# Altium project Group8_EnvironmentStation.PrjPcb
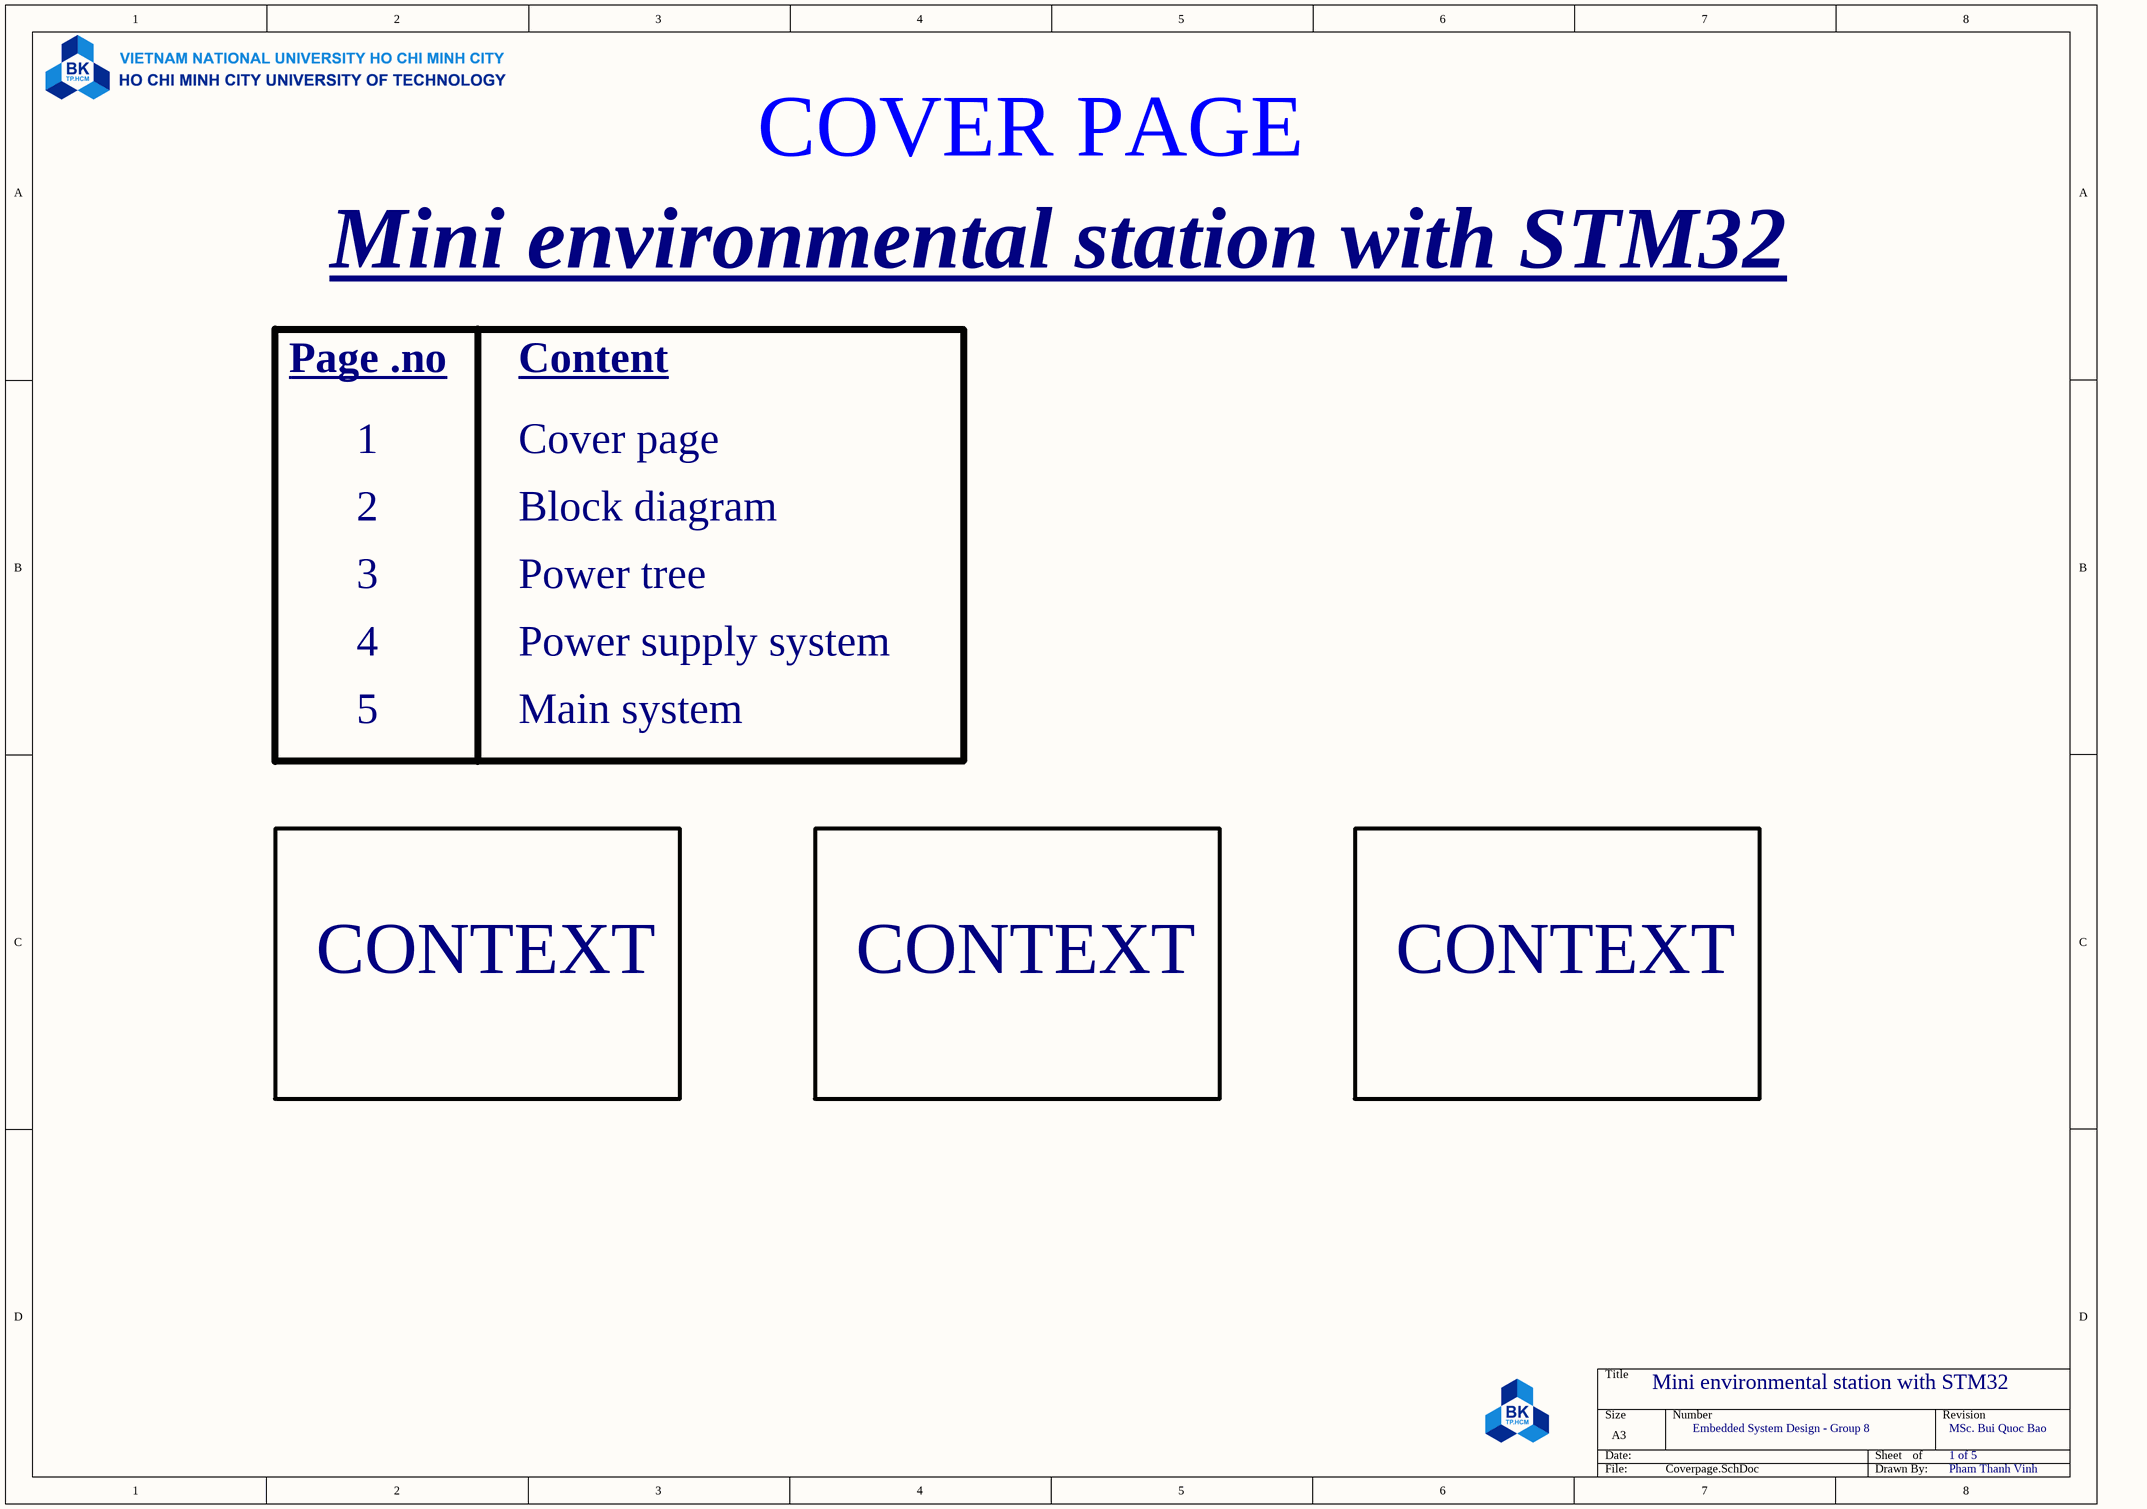
[diagram p0: Coverpage.SchDoc]
5 sheets, 60 parts. Net scope: flat (ports and power ports of the same name join across sheets).
Board file: enviromentstation.PcbDoc
Sheets:
  Coverpage.SchDoc
  Block_diagram_page.SchDoc
  Power_tree_page.SchDoc
  Powersupply.SchDoc
  Mainsystem.SchDoc

## Sheet Coverpage.SchDoc
size A3; SheetNumber: 1; SheetTotal: 5

### Notes on the sheet
- COVER PAGE
- Mini environmental station with STM32
- Page .no
- Content
- 1
- Cover page
- 2
- Block diagram
- 3
- Power tree
- 4
- Power supply system
- 5
- Main system
- CONTEXT
- Embedded System Design - Group 8
- MSc. Bui Quoc Bao
- 1 of 5
- Pham Thanh Vinh

## Sheet Block_diagram_page.SchDoc
size A3; SheetNumber: 2; SheetTotal: 5
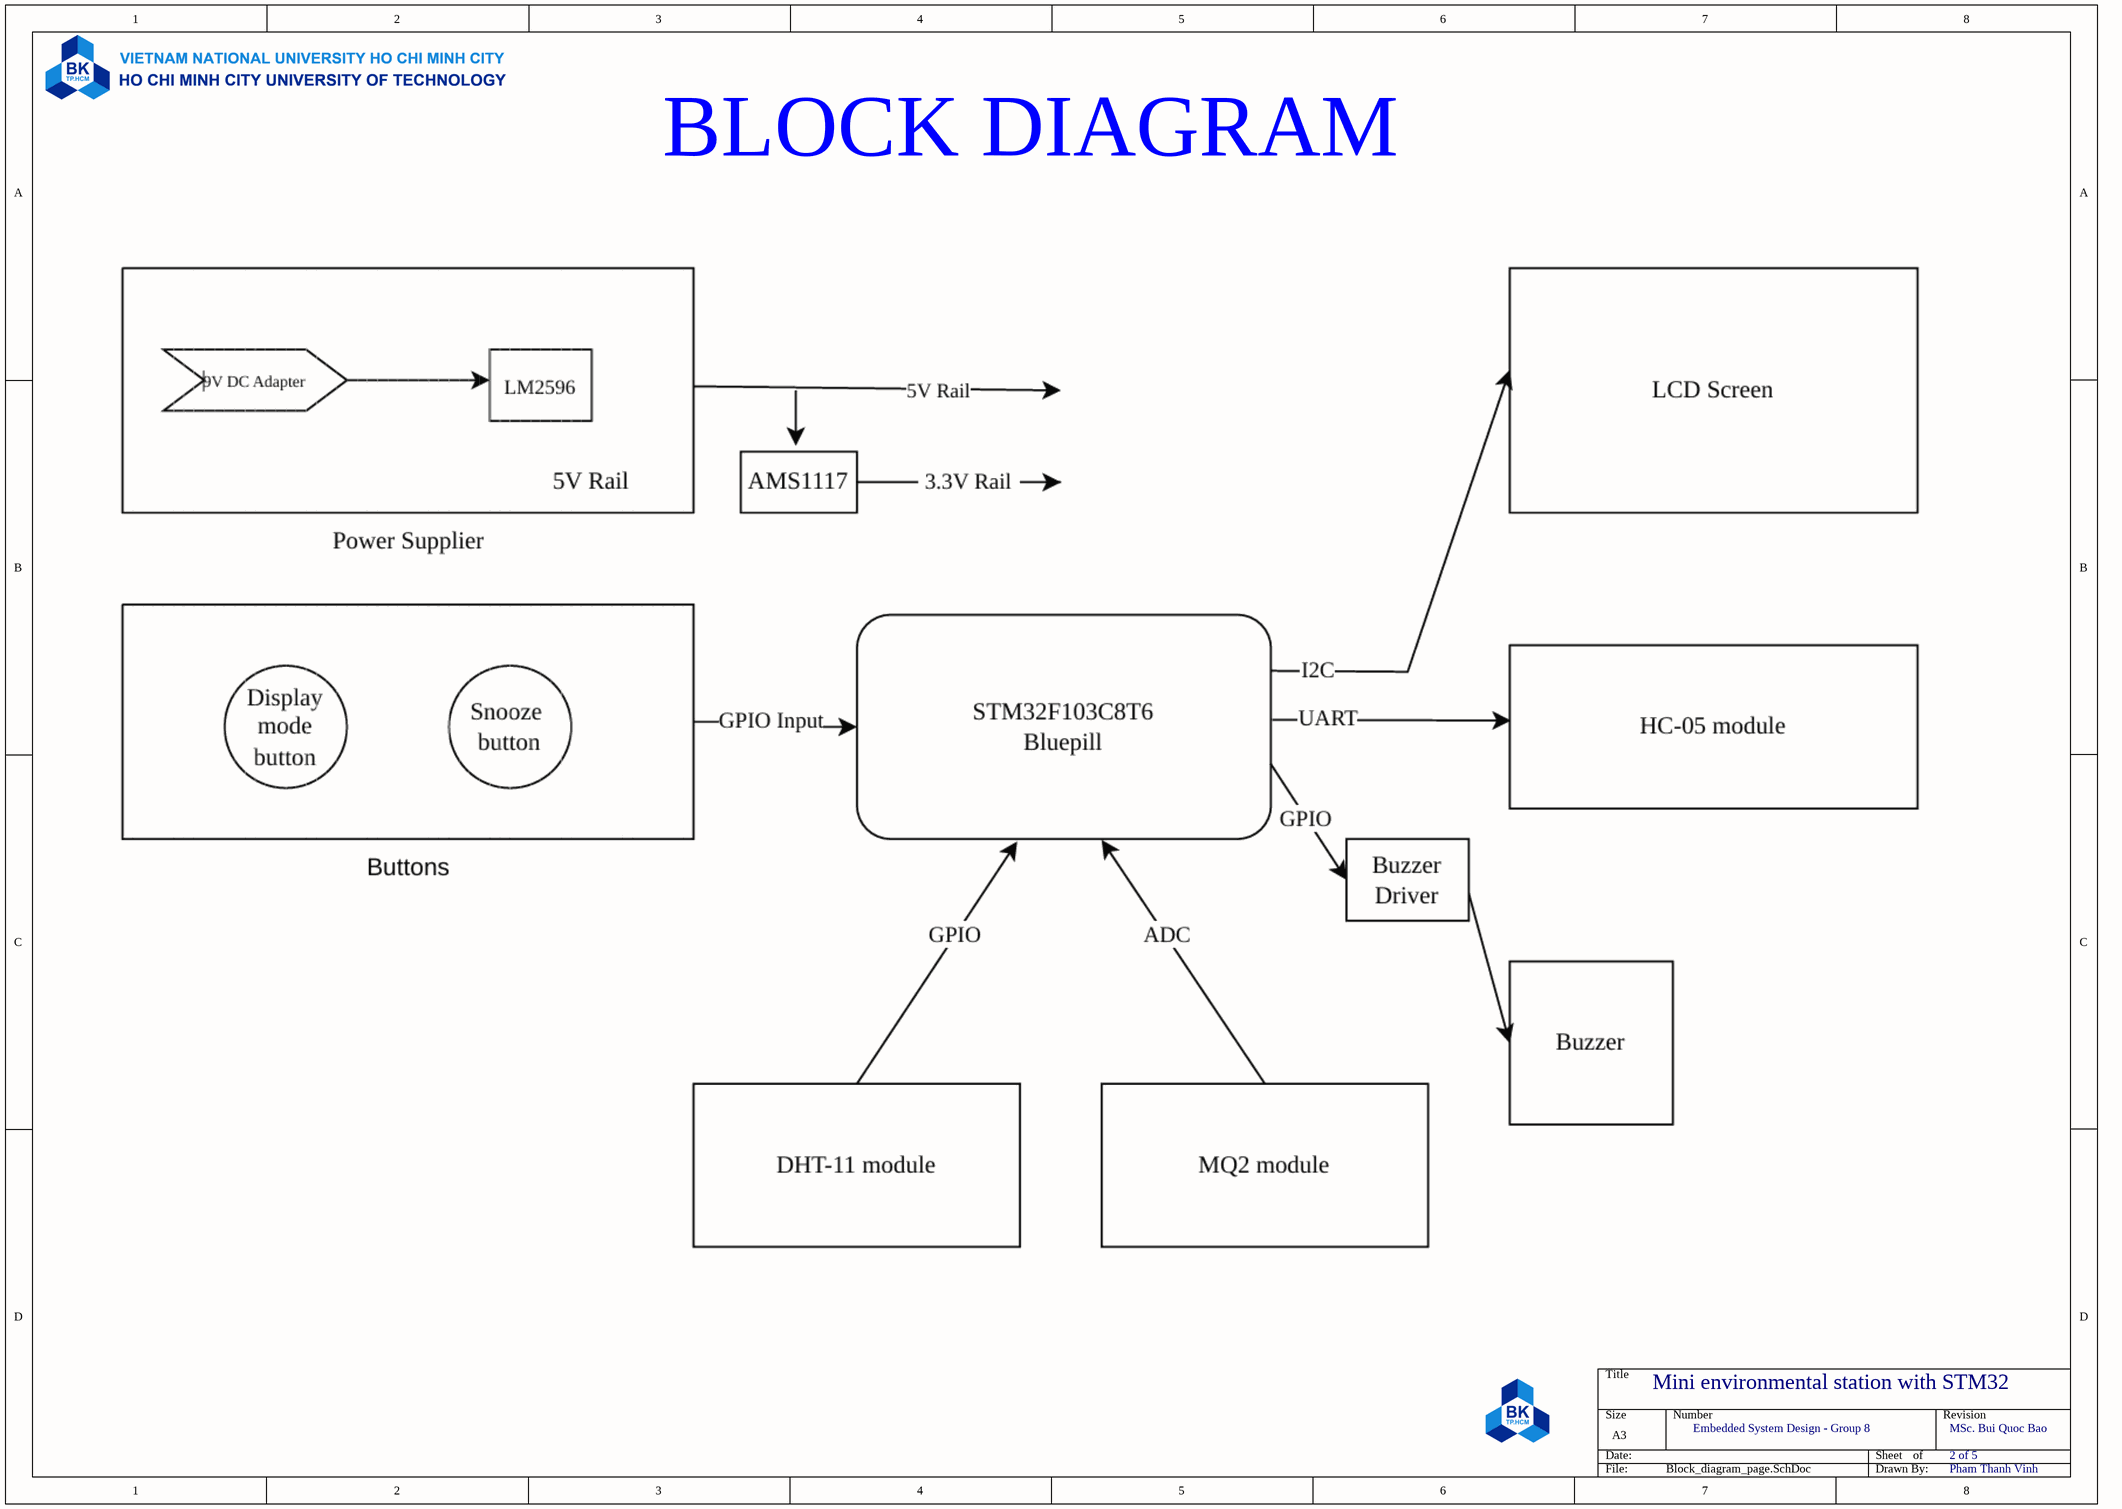
[diagram p1: Block_diagram_page.SchDoc]

### Notes on the sheet
- BLOCK DIAGRAM
- Mini environmental station with STM32
- Embedded System Design - Group 8
- MSc. Bui Quoc Bao
- 2 of 5
- Pham Thanh Vinh

## Sheet Power_tree_page.SchDoc
size A3; SheetNumber: 3; SheetTotal: 5
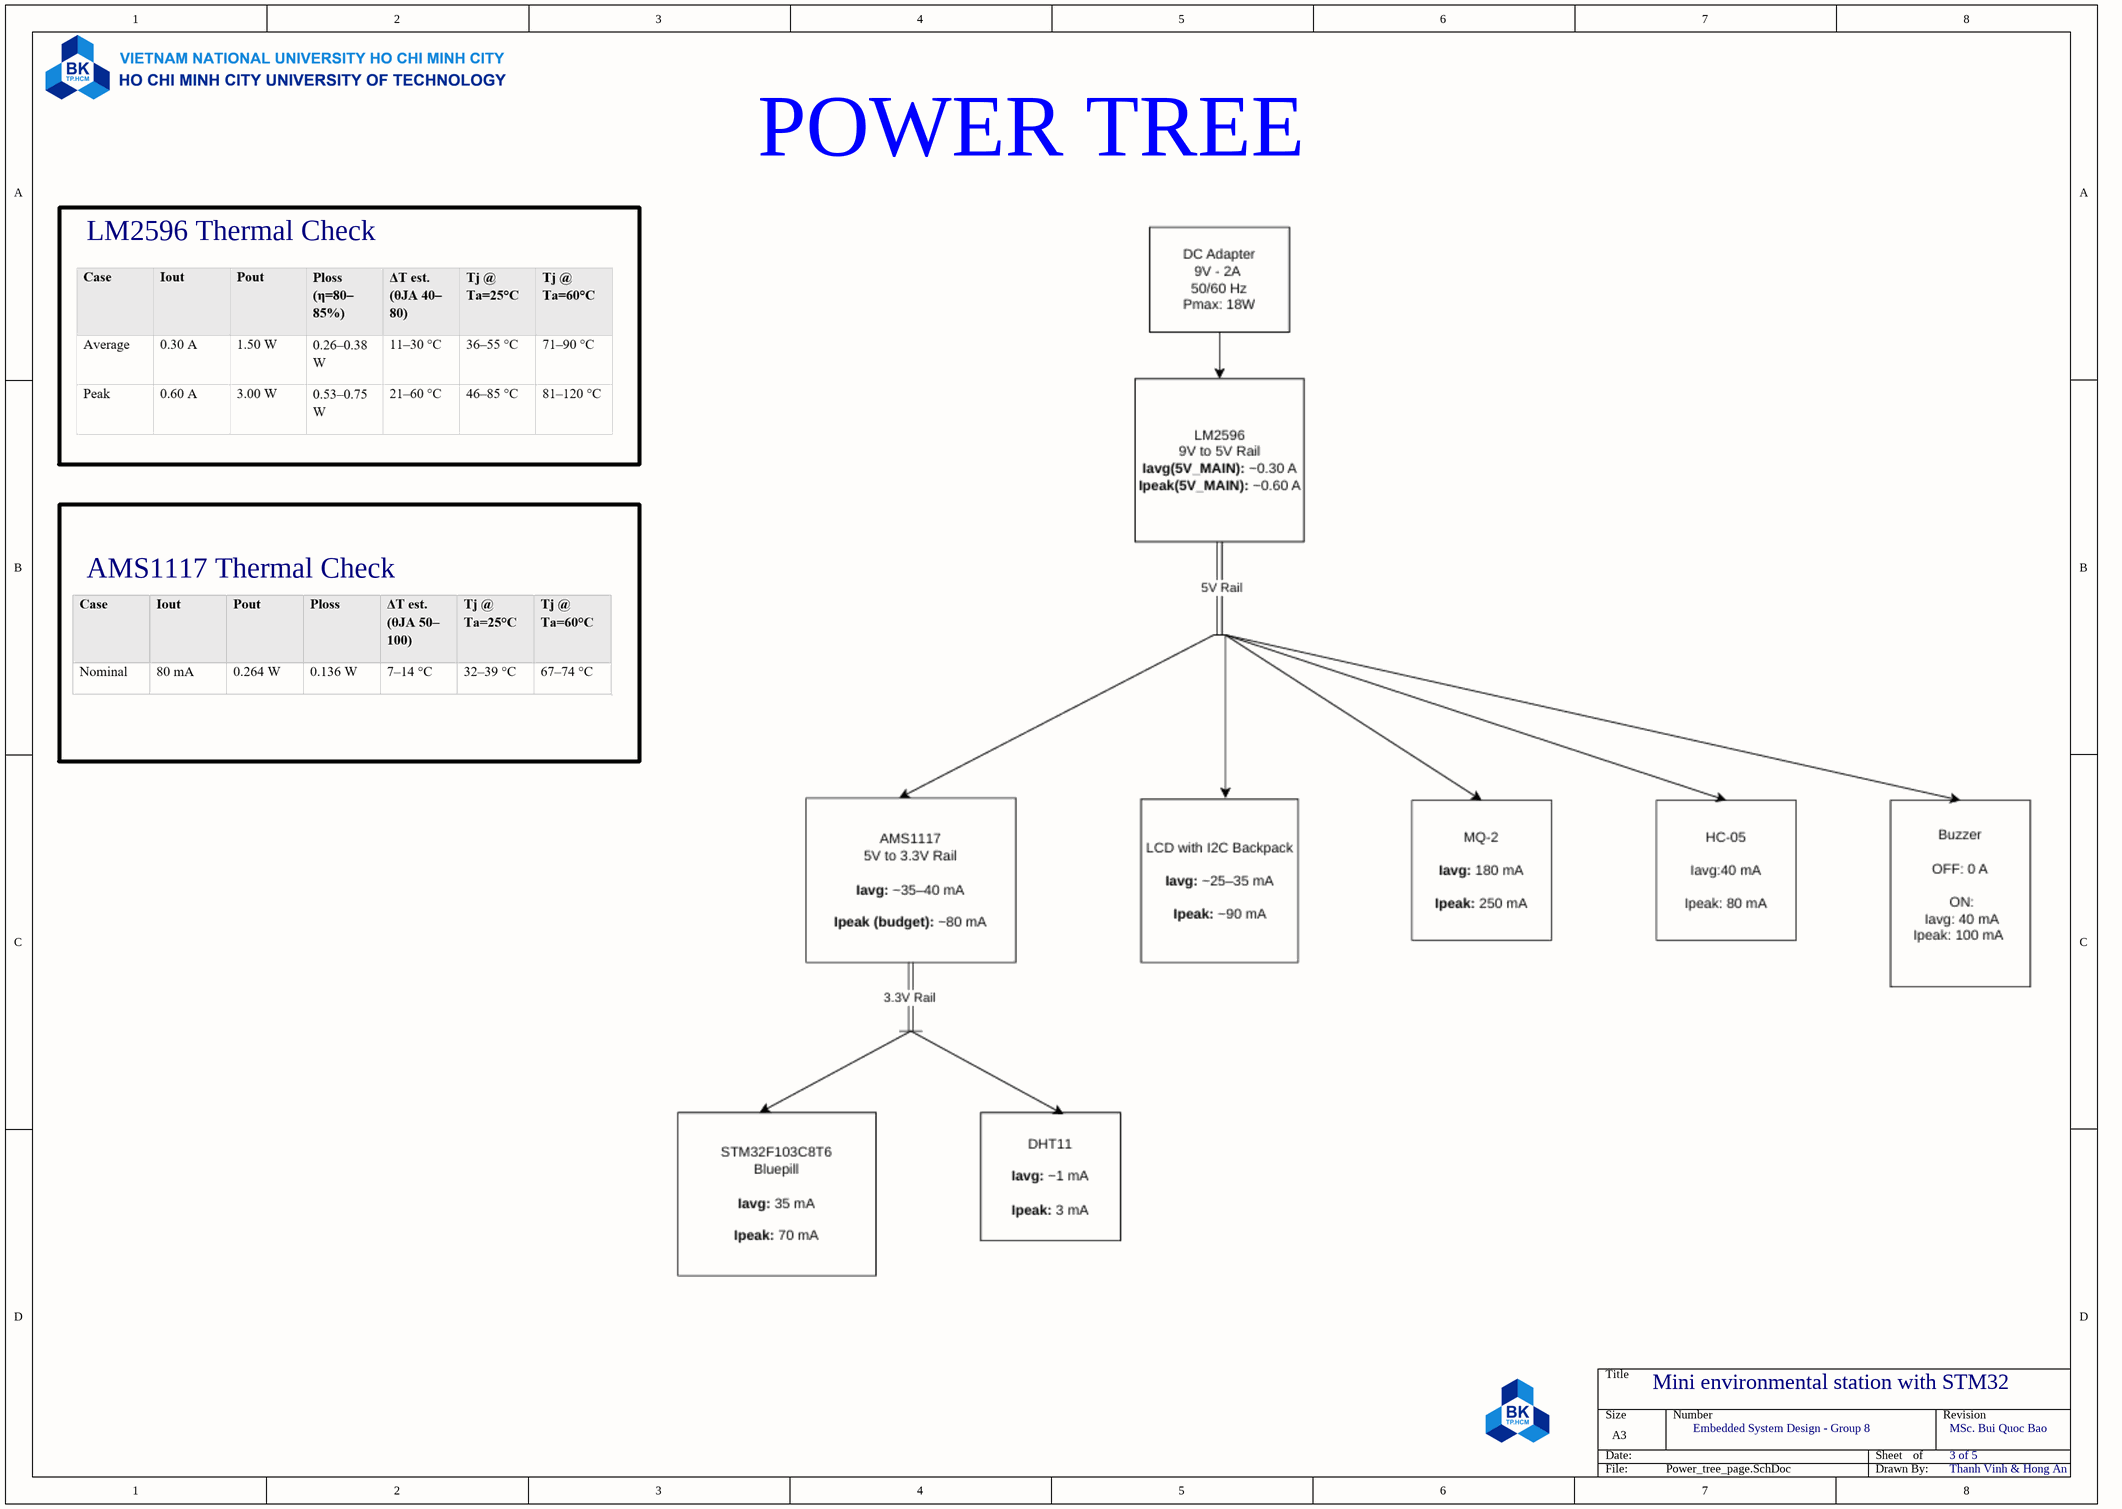
[diagram p2: Power_tree_page.SchDoc]

### Notes on the sheet
- POWER TREE
- LM2596 Thermal Check
- AMS1117 Thermal Check
- Mini environmental station with STM32
- Embedded System Design - Group 8
- MSc. Bui Quoc Bao
- 3 of 5
- Thanh Vinh & Hong An

## Sheet Powersupply.SchDoc
size A3; SheetNumber: 4; SheetTotal: 5
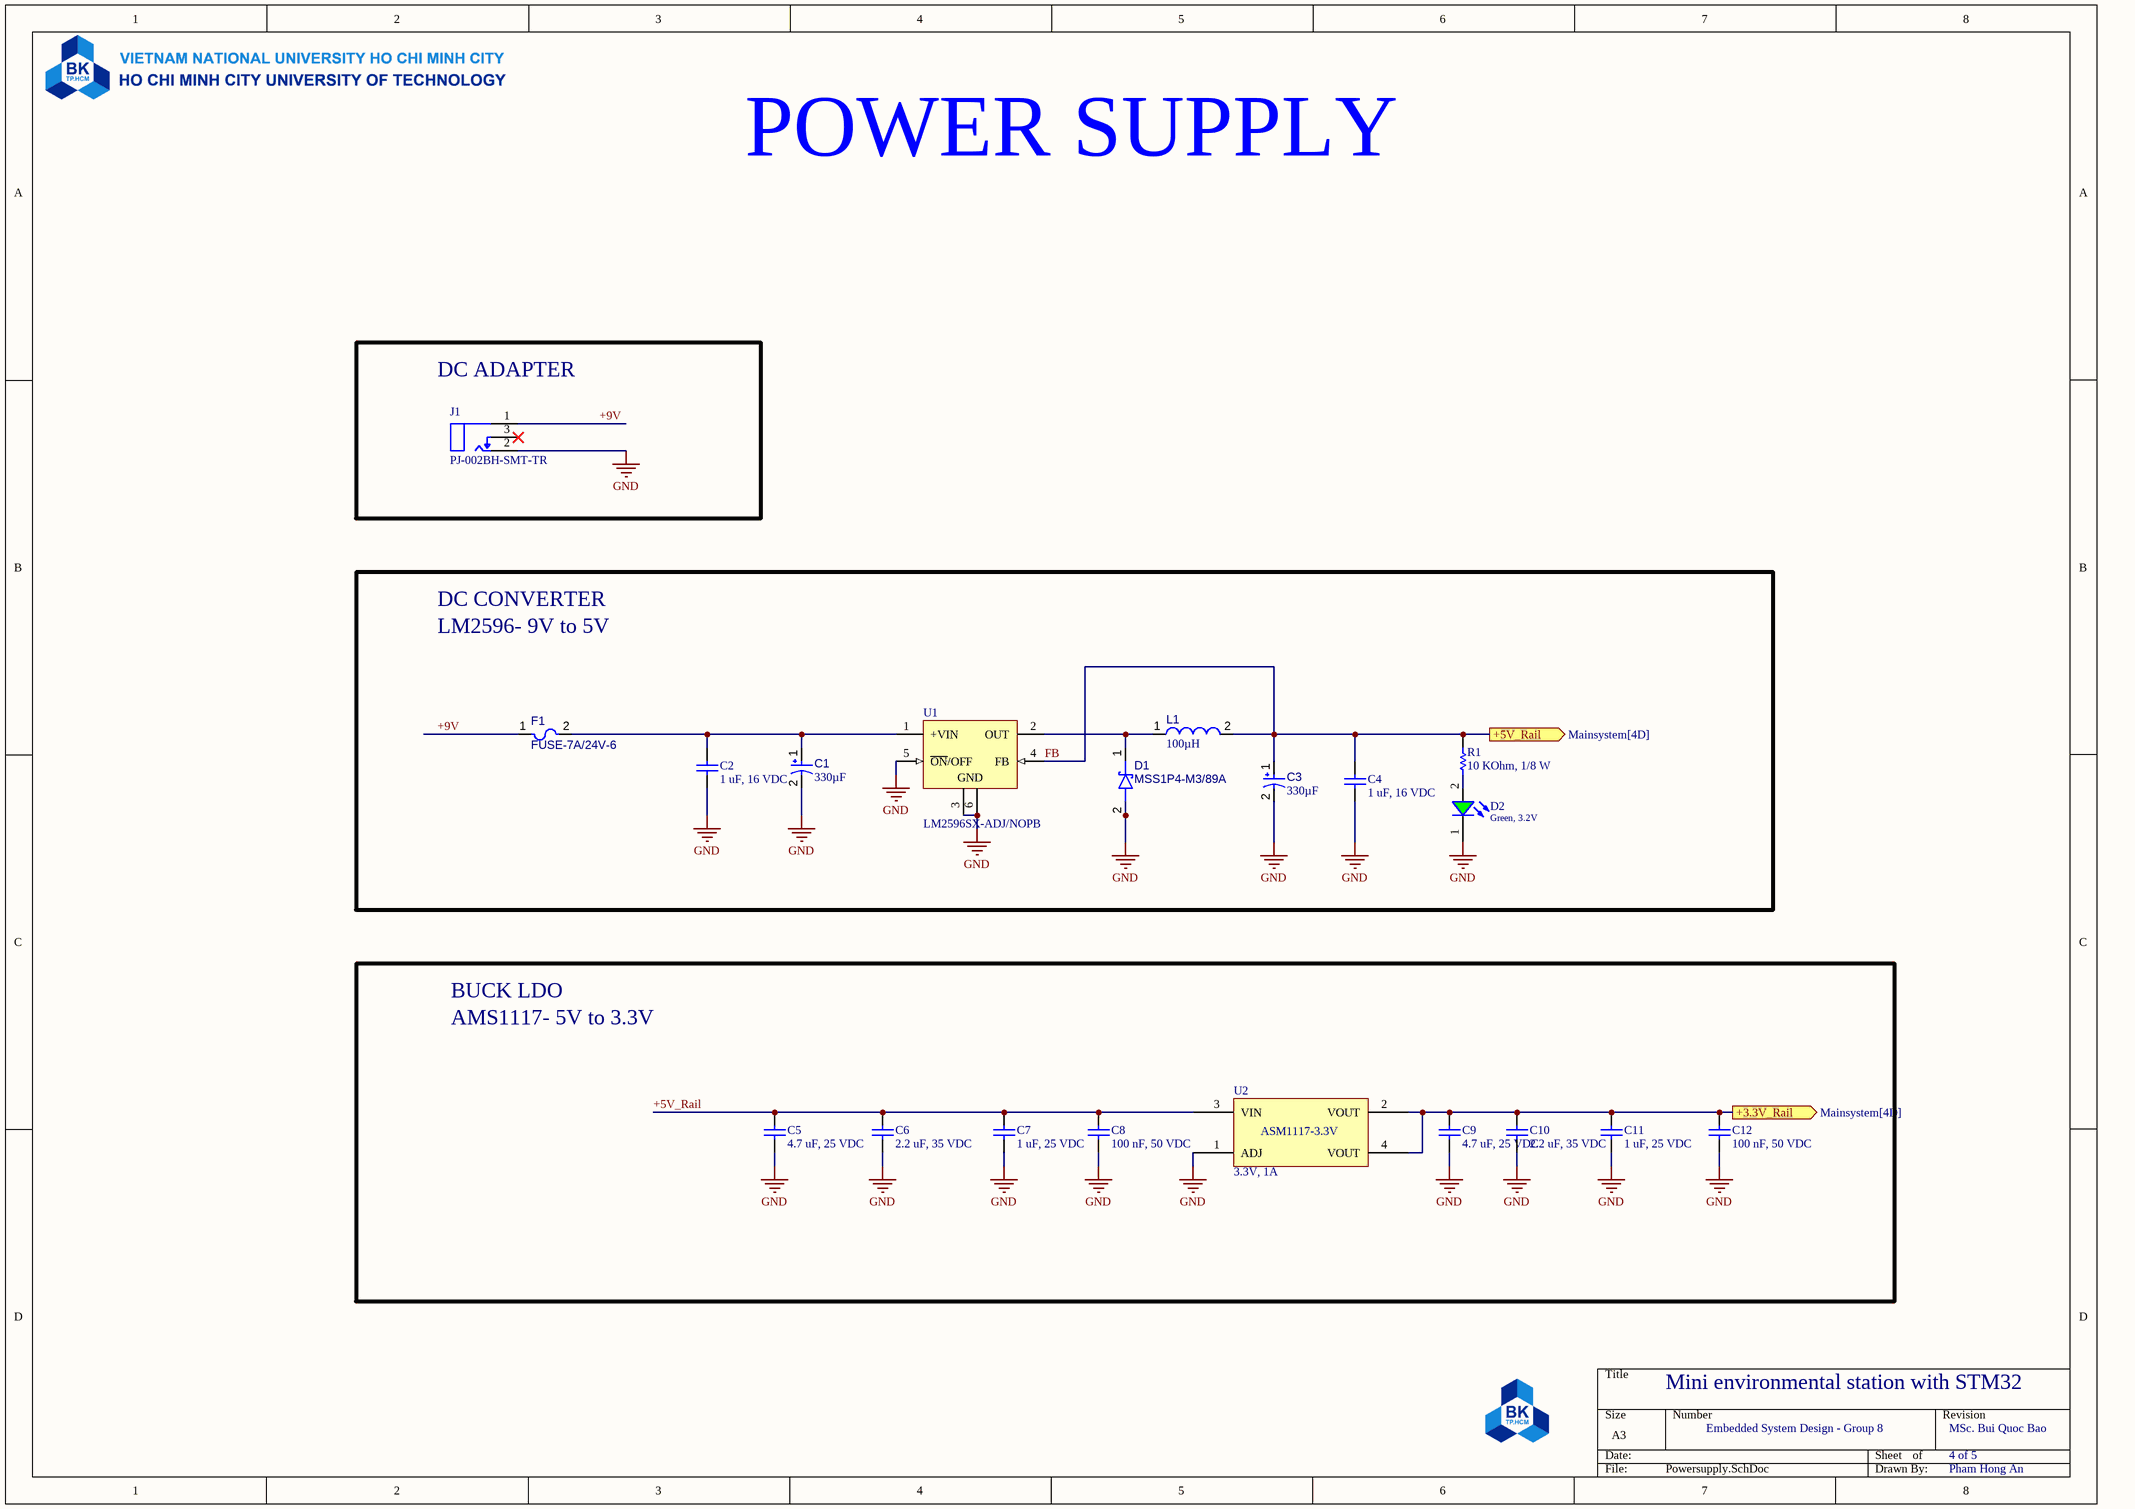
[diagram p3: Powersupply.SchDoc]

### Parts
C1  value 330µF  [PNSC-6TPF220M5L]  (hidden comment: Capacitor 330µF +/-20% 6.3V D3)
C2  1 uF, 16 VDC  [CAP_0805]
C3  value 330µF  [PNSC-6TPF220M5L]  (hidden comment: Capacitor 330µF +/-20% 6.3V D3)
C4  1 uF, 16 VDC  [CAP_0805]
C5  4.7 uF, 25 VDC  [CAP_0805]
C6  2.2 uF, 35 VDC  [CAP_0805]
C7  1 uF, 25 VDC  [CAP_0805]
C8  100 nF, 50 VDC  [CAP_0805]
C9  4.7 uF, 25 VDC  [CAP_0805]
C10  2.2 uF, 35 VDC  [CAP_0805]
C11  1 uF, 25 VDC  [CAP_0805]
C12  100 nF, 50 VDC  [CAP_0805]
D1  MSS1P4-M3/89A  [MicroSMP (DO-219AD)]
D2  Green, 3.2V  [WL-SMCW_0805]
F1  FUSE-7A/24V-6  [LFUS-466_V]
J1  PJ-002BH-SMT-TR  [FP-PJ-002BH-SMT-TR-MFG]
L1  value 100µH  [INDR62-500-1100X850X1100]  (hidden comment: RL622-101K-RC)
R1  10 KOhm, 1/8 W  [RESISTOR_0805]
U1  LM2596SX-ADJ/NOPB  [KTT0005B_L]
U2  3.3V, 1A  [AMS1117-3.3V SOT223]

### Blocks framed on the sheet
DC ADAPTER: J1

### Ports
+3.3V_Rail (out, see Mainsystem[4D]), +5V_Rail (out, see Mainsystem[4D])

### Nets
+3.3V: C9.2 C10.2 C11.2 C12.2 U2.2(VOUT) U2.4(VOUT) ; port +3.3V_Rail
FB: C3.1 C4.2 L1.2 R1.2 U1.4(FB) ; port +5V_Rail  [project net +5V]
GND: C1.2 C2.1 C3.2 C4.1 C5.1 C6.1 C7.1 C8.1 C9.1 C10.1 C11.1 C12.1 D1.2(A) D2.1(K) J1.2 U1.3(GND) U1.5(~{ON}/OFF) U1.6(GND) U2.1(ADJ)
+5V_Rail: C5.2 C6.2 C7.2 C8.2 U2.3(VIN)
+9V: F1.1 J1.1
NetC1_1: C1.1 C2.2 F1.2 U1.1(+VIN)
NetD1_1: D1.1(K) L1.1 U1.2(OUT)
NetD2_2: D2.2(A) R1.1

Not connected (* = marked no-connect by the designer): J1 3*

### Notes on the sheet
- POWER SUPPLY
- DC CONVERTER
- LM2596- 9V to 5V
- BUCK LDO
- AMS1117- 5V to 3.3V
- Mini environmental station with STM32
- Embedded System Design - Group 8
- MSc. Bui Quoc Bao
- 4 of 5
- Pham Hong An
- (in symbol AMS1117-3.3V) ASM1117-3.3V

### Library data of the parts
C1 C3 = CMP-001-00058-3: Molded Tantalum Polymer Capacitor, 330 uF, +/- 20%, 6.3 V, -55 to 105 degC, 2-Pin SMD, RoHS, Tape and Reel; Voltage Rating: 6.3V; Min Operating Temperature: -55°C; Tolerance: 20%; Pins: 2; Case/Package: 1210; Max Operating Temperature: 105°C; Mounting Technology: SMT
C2 C4 = 0108051051016: CAP, size 0805, 1 uF, 16 VDC; Manufacture Name: TDK; Manufacture SN: CGA4J2X7R1C105K125AA; Capacitance: 1 uF; Tolerance: +/-10%; Voltage Rating DC: 16 VDC; ComponentLink2Description: Datasheet; ComponentLink2URL: https://product.tdk.com/system/files/dam/doc/product/capacitor/ceramic/mlcc/catalog/mlcc_automotive_general_en.pdf?ref_disty=mouser; Operating Temperature: -55 to +125degC; Packaging: Tape and Reel; Mounting Technology: SMT; Size: 0805; Supplier 1 Name: Mouser; Supplier 1 SN: 810-CGA4J2X7R1C105K; Supplier 1 URL: https://www.mouser.vn/ProductDetail/TDK/CGA4J2X7R1C105K125AA?qs=NRhsANhppD8sFjo%252B1TQuCQ%3D%3D&utm_source=mouser-refine-download&utm_medium=file&utm_campaign=CGA4J2X7R1C105K125AA&utm_content=TDK; Supplier 2 Name: Digi-Key; Supplier 2 SN: 445-5689-2-ND; Supplier 2 URL: https://www.digikey.com/en/products/detail/tdk-corporation/cga4j2x7r1c105k125aa/2443167; Supplier 3 Name: thegioiic; Supplier 3 SN: OEM; Supplier 3 URL: N/A; Value: 1 uF, 16 VDC
C5 C9 = 0108054751025: CAP, size 0805, 4.7 uF, 25 VDC; Manufacture Name: TDK; Manufacture SN: CGA4J1X8L1E475K125AC; Capacitance: 4.7 uF; Tolerance: +/-10%; Voltage Rating DC: 25 VDC; ComponentLink2Description: Datasheet; ComponentLink2URL: https://product.tdk.com/system/files/dam/doc/product/capacitor/ceramic/mlcc/catalog/mlcc_automotive_hightemp_en.pdf?ref_disty=mouser; Operating Temperature: -55 to +125degC; Packaging: Tape and Reel; Mounting Technology: SMT; Size: 0805; Supplier 1 Name: Mouser; Supplier 1 SN: 810-CGA4J1X8L1E125AC; Supplier 1 URL: https://www.mouser.vn/ProductDetail/TDK/CGA4J1X8L1E475K125AC?qs=gZXFycFWdANxpKJOMQuJTA%3D%3D&utm_source=mouser-refine-download&utm_medium=file&utm_campaign=CGA4J1X8L1E475K125AC&utm_content=TDK; Supplier 2 Name: Digi-Key; Supplier 2 SN: 445-181605-2-ND; Supplier 2 URL: https://www.digikey.com/en/products/detail/tdk-corporation/cga4j1x8l1e475k125ac/9991390; Supplier 3 Name: thegioiic; Supplier 3 SN: OEM; Supplier 3 URL: N/A; Value: 4.7 uF, 25 VDC
C6 C10 = 0108052251035: CAP, size 0805, 2.2 uF, 35 VDC; Manufacture Name: TDK; Manufacture SN: CGA4J1X7R1V225K125AC; Capacitance: 2.2 uF; Tolerance: +/-10%; Voltage Rating DC: 35 VDC; ComponentLink2Description: Datasheet; ComponentLink2URL: https://product.tdk.com/system/files/dam/doc/product/capacitor/ceramic/mlcc/catalog/mlcc_automotive_general_en.pdf?ref_disty=mouser; Operating Temperature: -55 to +125degC; Packaging: Tape and Reel; Mounting Technology: SMT; Size: 0805; Supplier 1 Name: Mouser; Supplier 1 SN: 810-CGA4J1X7R1V225K; Supplier 1 URL: https://www.mouser.vn/ProductDetail/TDK/CGA4J1X7R1V225K125AC?qs=NRhsANhppD%2FTd0jz18r29g%3D%3D&utm_source=mouser-refine-download&utm_medium=file&utm_campaign=CGA4J1X7R1V225K125AC&utm_content=TDK; Supplier 2 Name: Digi-Key; Supplier 2 SN: 445-6963-2-ND; Supplier 2 URL: https://www.digikey.com/en/products/detail/tdk-corporation/cga4j1x7r1v225k125ac/2672856; Supplier 3 Name: thegioiic; Supplier 3 SN: OEM; Supplier 3 URL: N/A; Value: 2.2 uF, 35 VDC
C7 C11 = 0108051051025: CAP, size 0805, 1 uF, 25 VDC; Manufacture Name: TDK; Manufacture SN: CGA4J1X8R1E105K125AE; Capacitance: 1 uF; Tolerance: +/-10%; Voltage Rating DC: 25 VDC; ComponentLink2Description: Datasheet; ComponentLink2URL: https://product.tdk.com/system/files/dam/doc/product/capacitor/ceramic/mlcc/catalog/mlcc_automotive_soft_en.pdf?ref_disty=mouser; Operating Temperature: -55 to +125degC; Packaging: Tape and Reel; Mounting Technology: SMT; Size: 0805; Supplier 1 Name: Mouser; Supplier 1 SN: 810-A4J1X815K125AE; Supplier 1 URL: https://www.mouser.vn/ProductDetail/TDK/CGA4J1X8R1E105K125AE?qs=Ii670aiJhr6VRhkBsruYJg%3D%3D&utm_source=mouser-refine-download&utm_medium=file&utm_campaign=CGA4J1X8R1E105K125AE&utm_content=TDK; Supplier 2 Name: Digi-Key; Supplier 2 SN: 445-174807-2-ND; Supplier 2 URL: https://www.digikey.com/en/products/detail/tdk-corporation/cga4j1x8r1e105k125ae/6556490; Supplier 3 Name: thegioiic; Supplier 3 SN: OEM; Supplier 3 URL: N/A; Value: 1 uF, 25 VDC
C8 C12 = 0108051041050: CAP, size 0805, 100 nF, 50 VDC; Manufacture Name: TDK; Manufacture SN: CGA4J2X8R1H104K125AD; Capacitance: 0.1 nF; Tolerance: +/-10%; Voltage Rating DC: 50 VDC; Value: 0.1 nF, 50 VDC; ComponentLink2Description: Datasheet; ComponentLink2URL: https://product.tdk.com/system/files/dam/doc/product/capacitor/ceramic/mlcc/catalog/mlcc_automotive_epoxy_en.pdf?ref_disty=mouser; Operating Temperature: -55 to +125degC; Packaging: Tape and Reel; Mounting Technology: SMT; Size: 0805; Supplier 1 Name: Mouser; Supplier 1 SN: 810-C2012X8R1H104KEP; Supplier 1 URL: https://www.mouser.vn/ProductDetail/TDK/CGA4J2X8R1H104K125AD?qs=LcTL%2F5vFEzExqZqv3rh1qQ%3D%3D&utm_source=mouser-refine-download&utm_medium=file&utm_campaign=CGA4J2X8R1H104K125AD&utm_content=TDK; Supplier 2 Name: Digi-Key; Supplier 2 SN: 445-8810-2-ND; Supplier 2 URL: https://www.digikey.com/en/products/detail/tdk-corporation/cga4j2x8r1h104k125ad/3248169; Supplier 3 Name: thegioiic; Supplier 3 SN: OEM; Supplier 3 URL: N/A
D1 = CMP-004-00024-3: Schottky Diodes & Rectifiers 1.0 Amp 40 Volt; Forward Voltage: 460mV; Max Surge Current: 25A; Max Operating Temperature: 150°C; Min Operating Temperature: -55°C; Pins: 2; Mounting Technology: SMT
D2 = 160805GreenBlur: WL-SMCW SMT Mono-color Chip LED Blur, size 0805, Green, 3.2V, 140deg; Color: Green; Size: 0603; Type: Blur; ComponentLink1Description: Datasheet link; ComponentLink1URL: N/A; ComponentLink2Description: Supplier 1 URL; ComponentLink2URL: https://www.mouser.vn/ProductDetail/Broadcom-Avago/HSMG-C170?qs=YDL0qNrpDT4lm8ArMPkMEA%3D%3D; ComponentLink3Description: Supplier 2 URL; ComponentLink3URL: SML-LXT0805GW-TR Lumex Opto/Components Inc. | Optoelectronics | DigiKey; ComponentLink4Description: Supplier 3 URL; ComponentLink4URL: N/A; Supplier 1 Name: Mouser; Supplier 1 SN: 630-HSMG-C170; Supplier 1 URL: https://www.mouser.vn/ProductDetail/Broadcom-Avago/HSMG-C170?qs=YDL0qNrpDT4lm8ArMPkMEA%3D%3D; Supplier 2 Name: Digi-Key; Supplier 2 SN: 67-1553-2-ND; Supplier 2 URL: SML-LXT0805GW-TR Lumex Opto/Components Inc. | Optoelectronics | DigiKey; Supplier 3 Name: ICDayRoi; Supplier 3 SN: N/A; Supplier 3 URL: N/A; Value: Green, 3.2V
F1 = CMP-005-00010-2: Surface Mount Fuses 7A 24V VFA SLIMLINE; Current Rating: 7A; Pins: 2
J1 = CMP-2000-06897-2: CONN PWR JACK 2.5X5.5MM SOLDER; Manufacturer: CUI Inc; Current Rating: 5A; Standoff Height: 0.1mm; Voltage Rating: 24V; Conn Gender: Male; Conn Orientation: Right Angle; Number Of Contacts: 3; Temperature Range Low: -25°C; Category: Conn; Package: 0; Device Class L2: Power Connectors; Contact Material: Nickel,Silver; Automotive: No; Mouser Description: 2.5 mm Center Pin, 5.0 A, Right Angle, Surface Mount (SMT), Dc Power Jack Connector; Device Class L3: unset; ComponentLink2URL: https://www.cuidevices.com/product/resource/digikeypdf/pj-002bh-smt-tr.pdf; Octopart: https://octopart.com/pj-002bh-smt-tr-cui-25947151; Manufacturer Part Number: PJ-002BH-SMT-TR; Lead Free: Yes; ComponentLink2Description: Datasheet; Digikey Description: CONN PWR JACK 2.5X5.5MM SOLDER; Height: 11.43mm; Temperature: -25°C to +85°C; RoHS: TRUE; Device Class L1: Connectors; Temperature Range High: +85°C
L1 = CMP-006-00013-6: Radial Inductor, 100 uH, +/- 10%, 0.91 A, -55 to 105 degC, 2-Pin THD, RoHS, Bulk; Manufacturer: Bourns; Q Factor: 20; Shielding: Unshielded; Core Material: Ferrite; Self Resonant Frequency: 3.7MHz; Resistance: 0.28Ohm; Current Rating: 910mA; Datasheet URL: http://www.bourns.com/docs/Product-Datasheets/rl622_series.pdf; Pins: 2; Inductance Tolerance: 10%; Packaging: Bulk; Tolerance: 10%; Diameter: 8.5mm; RoHS Compliant: True; Max Operating Temperature: 105°C; Package Quantity: 100; Package Reference: INDR62-500-1100X850X1100; Mounting Technology: TH; Lead Pitch: 5mm; Datasheet Version: Aug-10; Min Operating Temperature: -55°C; Package Description: 2-Pin Radial Lead, Dia 8.5 mm, Pitch 5 mm; Case/Package: Radial
R1 = 0008051035: RES, size 0805, 10 KOhm, 1/8 W; Manufacture  Name: Vishay Dale; Manufacture  SN: CRCW080510K0JNEAC; Resistance tolerance: +/-5%; Rated Power: 1/8 W; Resistance: 10 KOhm; Size: 0805; Mounting Technology: SMT; Supplier 1 Name: Mouser; Supplier 1 SN: 71-CRCW080510K0JNEB; Supplier 1 URL: https://www.mouser.vn/ProductDetail/Vishay-Dale/CRCW080510K0JNEB?qs=LOX6nxTstiZ5fn9YUdHx5A%3D%3D; Supplier 2 Name: Digi-Key; Supplier 2 SN: 541-4163-2-ND; Supplier 2 URL: https://www.digikey.com/en/products/detail/vishay-dale/CRCW080510K0JNEAC/7928585; Supplier 3 Name: Thegioiic; Supplier 3 SN: N/A; Supplier 3 URL: N/A; Value: 10 KOhm, 1/8 W; ComponentLink1Description: Datasheet link; ComponentLink1URL: https://www.vishay.com/docs/28773/crcwce3.pdf; ComponentLink2Description: Supplier 1 URL; ComponentLink2URL: https://www.mouser.vn/ProductDetail/Vishay-Dale/CRCW080510K0JNEB?qs=LOX6nxTstiZ5fn9YUdHx5A%3D%3D; ComponentLink3Description: Supplier 2 URL; ComponentLink3URL: https://www.digikey.com/en/products/detail/vishay-dale/CRCW080510K0JNEAC/7928585; ComponentLink4Description: Supplier 3 URL; ComponentLink4URL: N/A
U1 = CMP-2000-06545-1: Simple Switcher(R) Power Converter 150 kHz Step-Down Voltage Regulator, 3 A, 4.5 to 40 V, -40 to 125 degC, 5-Pin TO-263 (KTT), Green (RoHS & no Sb/Br), Tape and Reel; PartNumber: LM2596; Manufacturer: Texas Instruments; Package Version: 4200577-4/G, 01/2013; Primary Input Voltage: 40V; No. of Outputs: 1; No. of Pins: 5; SVHC: NoSVHC(19-Dec-2012); Output Voltage: 37V; Output Current: 3A; Datasheet Version: Rev. C, 04/2013; Package Reference: KTT5; MSL: MSL3-168hours; Number of Outputs: 1; Operating Temperature Min: -40°C; Operating Temperature Range: -40°Cto+125°C; Manufacturer URL: http://www.ti.com/; Package URL: http://www.ti.com/litv/pdf/mpsf007e; Voltage Regulator Case Style: TO-263; Operating Temperature Max: 125°C; Package Description: 5-Pin Plastic Flange Mount, Body 10.16 x 8.925 mm, Pitch 1.7 mm; Datasheet URL: http://www.ti.com/lit/ds/symlink/lm2596.pdf; Mounting Technology: SurfaceMount
U2 = AMS1117-3.3V: AMS1117-3.3V, OUT 3.3V 1A.; Manufacturer: AMS; Pad Count: 4; Voltage Input Maximum: 15V; Manufacturer Part Number: N/A; Current Input Maximum: N/A; Current Output Maximum: 1A; Supplier 1 Name: Mouser; Supplier 2 Name: Digi-Key; Supplier 3 Name: thegioiic; Voltage Output: 3.3V; Mounting Technology: SMD; ComponentLink1Description: Datasheet link; ComponentLink1URL: http://www.advanced-monolithic.com/pdf/ds1117.pdf; ComponentLink2Description: Supplier 1 URL; ComponentLink2URL: N/A; ComponentLink3Description: Supplier 2 URL; ComponentLink3URL: N/A; ComponentLink4Description: Supplier 3 URL; ComponentLink4URL: N/A; Supplier 1 SN: N/A; Supplier 1 URL: N/A; Supplier 2 SN: N/A; Supplier 2 URL: N/A; Supplier 3 SN: N/A; Supplier 3 URL: https://www.thegioiic.com/ams1117-3-3v-ic-on-ap-3-3v-1a-sot-223; Value: 3.3V, 1A

## Sheet Mainsystem.SchDoc
size A3; SheetNumber: 5; SheetTotal: 5
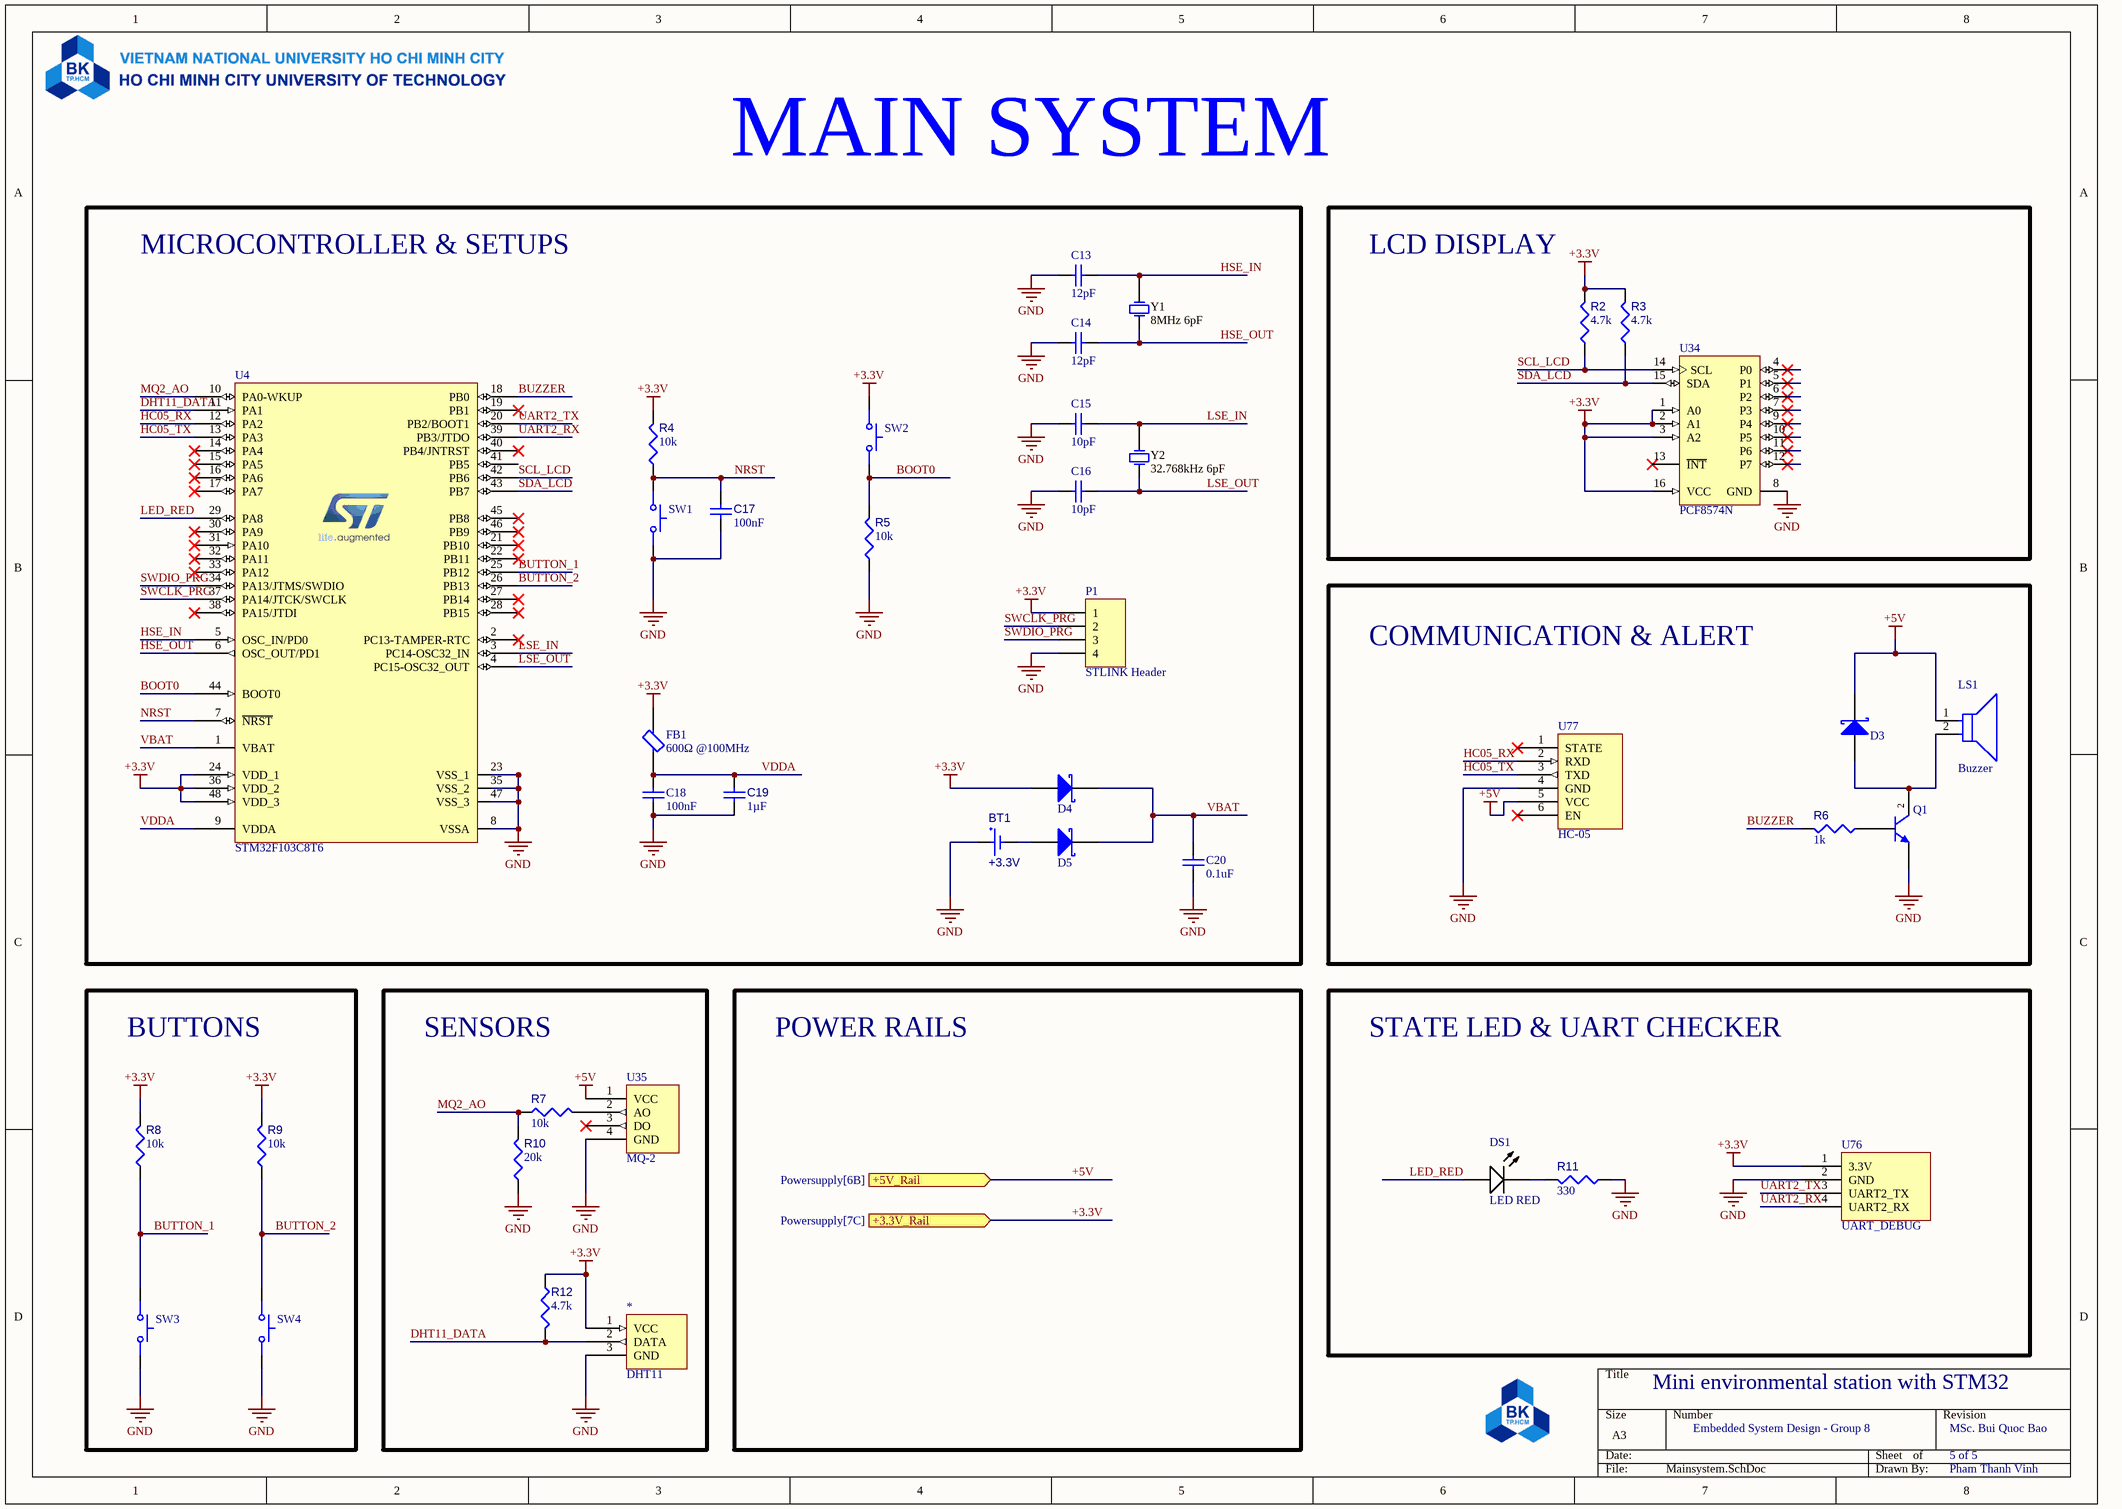
[diagram p4: Mainsystem.SchDoc]

### Parts
*  DHT11  [HDR1X3]
BT1  +3.3V  [SEIK-MS621FE-FL11E-2_V]
C13  value 12pF  [CAPC1608X90X35ML15T15]  (hidden comment: Capacitor 1uF +/- 10% 16V 0603)
C14  value 12pF  [CAPC1608X90X35ML15T15]  (hidden comment: Capacitor 1uF +/- 10% 16V 0603)
C15  value 10pF  [CAPC1608X90X35ML15T15]  (hidden comment: Capacitor 1uF +/- 10% 16V 0603)
C16  value 10pF  [CAPC1608X90X35ML15T15]  (hidden comment: Capacitor 1uF +/- 10% 16V 0603)
C17  value 100nF  [CAPC0402(1005)60_L]  (hidden comment: Capacitor 100nF +/-20% 10V 0402)
C18  value 100nF  [CAPC1608X90X35ML15T15]  (hidden comment: Capacitor 1uF +/- 10% 16V 0603)
C19  value 1µF  [CAPC1608X90X35ML15T15]  (hidden comment: Capacitor 1uF +/- 10% 16V 0603)
C20  value 0.1uF  [CAPC1608X90X35ML15T15]  (hidden comment: Capacitor 1uF +/- 10% 16V 0603)
D3  B5819W  [MCC-SOD123_V]  (value not drawn)
D4  B5819W  [MCC-SOD123_V]  (value not drawn)
D5  B5819W  [MCC-SOD123_V]  (value not drawn)
DS1  LED RED  [EVRL-0402-2_V]
FB1  600Ω @100MHz  [FP-BLM21-0_2-t0_85-e0_5-IPC_B]
LS1  Buzzer  [FP-CT-1205CL-SMT-TR-MFG]
P1  STLINK Header  [JP4]
Q1  MMBT2222A  [MMBT-SOT23]  (value not drawn)
R2  value 4.7k  [RESC0402(1005)_L]  (hidden comment: 10KR2F)
R3  value 4.7k  [RESC0402(1005)_L]  (hidden comment: 10KR2F)
R4  value 10k  [RESC0402(1005)_L]  (hidden comment: 10KR2F)
R5  value 10k  [RESC0402(1005)_L]  (hidden comment: 10KR2F)
R6  value 1k  [RESC0402(1005)_L]  (hidden comment: 10KR2F)
R7  value 10k  [RESC0402(1005)_L]  (hidden comment: 10KR2F)
R8  value 10k  [RESC0402(1005)_L]  (hidden comment: 10KR2F)
R9  value 10k  [RESC0402(1005)_L]  (hidden comment: 10KR2F)
R10  value 20k  [RESC0402(1005)_L]  (hidden comment: 10KR2F)
R11  value 330  [RESC0402(1005)_L]  (hidden comment: 10KR2F)
R12  value 4.7k  [RESC0402(1005)_L]  (hidden comment: 10KR2F)
SW1  B3U-1000P-B  [OMRON-B3U-1000P-2-B_V]  (value not drawn)
SW2  B3U-1000P-B  [OMRON-B3U-1000P-2-B_V]  (value not drawn)
SW3  B3U-1000P-B  [OMRON-B3U-1000P-2-B_V]  (value not drawn)
SW4  B3U-1000P-B  [OMRON-B3U-1000P-2-B_V]  (value not drawn)
U4  STM32F103C8T6  [STM32F103C8T6]
U34  PCF8574N  [N0016A]
U35  MQ-2  [HDR1X4]
U76  UART_DEBUG  [HDR1X4]
U77  HC-05  [HDR1X6]
Y1  8MHz 6pF  [FOX-HC49SDLF_V]
Y2  32.768kHz 6pF  [FOX-HC49SDLF_V]

### Blocks framed on the sheet
MICROCONTROLLER & SETUPS: BT1 C13-C20 D4 D5 FB1 P1 R4 R5 SW1 SW2 U4 Y1 Y2
LCD DISPLAY: R2 R3 U34
COMMUNICATION & ALERT: D3 LS1 Q1 R6 U77
BUTTONS: R8 R9 SW3 SW4
SENSORS: * R7 R10 R12 U35
STATE LED & UART CHECKER: DS1 R11 U76

### Ports
+3.3V_Rail (in, see Powersupply[7C]), +5V_Rail (in, see Powersupply[6B])

### Nets
+3.3V: *.1(VCC) D4.1(A) FB1.2 P1.1 R2.2 R3.2 R4.2 R8.2 R9.2 R12.1 SW2.1 U4.24(VDD_1) U4.36(VDD_2) U4.48(VDD_3) U34.1(A0) U34.2(A1) U34.3(A2) U34.16(VCC) U76.1(3.3V) ; port +3.3V_Rail
+5V: D3.2(K) LS1.1(C) U35.1(VCC) U77.5(VCC) ; port +5V_Rail
GND: *.3(GND) BT1.1(+) C13.1 C14.1 C15.1 C16.1 C17.1 C18.1 C19.1 C20.1 P1.4 Q1.3(E) R5.1 R10.1 R11.1 SW1.2 SW3.2 SW4.2 U4.8(VSSA) U4.23(VSS_1) U4.35(VSS_2) U4.47(VSS_3) U34.8(GND) U35.4(GND) U76.2(GND) U77.4(GND)
BOOT0: R5.2 SW2.2 U4.44(BOOT0)
BUTTON_1: R8.1 SW3.1 U4.25(PB12)
BUTTON_2: R9.1 SW4.1 U4.26(PB13)
BUZZER: R6.2 U4.18(PB0)
DHT11_DATA: *.2(DATA) R12.2 U4.11(PA1)
HC05_RX: U4.12(PA2) U77.2(RXD)
HC05_TX: U4.13(PA3) U77.3(TXD)
HSE_IN: C13.2 U4.5(OSC_IN/PD0) Y1.1
HSE_OUT: C14.2 U4.6(OSC_OUT/PD1) Y1.2
LED_RED: DS1.1(A) U4.29(PA8)
LSE_IN: C15.2 U4.3(PC14-OSC32_IN) Y2.1
LSE_OUT: C16.2 U4.4(PC15-OSC32_OUT) Y2.2
MQ2_AO: R7.1 R10.2 U4.10(PA0-WKUP)
NRST: C17.2 R4.1 SW1.1 U4.7(~{NRST})
SCL_LCD: R2.1 U4.42(PB6) U34.14(SCL)
SDA_LCD: R3.1 U4.43(PB7) U34.15(SDA)
SWCLK_PRG: P1.2 U4.37(PA14/JTCK/SWCLK)
SWDIO_PRG: P1.3 U4.34(PA13/JTMS/SWDIO)
UART2_RX: U4.39(PB3/JTDO) U76.4(UART2_RX)
UART2_TX: U4.20(PB2/BOOT1) U76.3(UART2_TX)
VBAT: C20.2 D4.2(K) D5.2(K) U4.1(VBAT)
VDDA: C18.2 C19.2 FB1.1 U4.9(VDDA)
NetBT1_2: BT1.2(-) D5.1(A)
NetD3_1: D3.1(A) LS1.2(A) Q1.2(C)
NetDS1_2: DS1.2(K) R11.2
NetQ1_1: Q1.1(B) R6.1
NetR7_2: R7.2 U35.2(AO)

Not connected (* = marked no-connect by the designer): U4 2(PC13-TAMPER-RTC)* 14(PA4)* 15(PA5)* 16(PA6)* 17(PA7)* 19(PB1)* 21(PB10)* 22(PB11)* 27(PB14)* 28(PB15)* 30(PA9)* 31(PA10)* 32(PA11)* 33(PA12)* 38(PA15/JTDI)* 40(PB4/JNTRST)* 41(PB5) 45(PB8)* 46(PB9)*; U34 4(P0)* 5(P1)* 6(P2)* 7(P3)* 9(P4)* 10(P5)* 11(P6)* 12(P7)* 13(~{INT})*; U35 3(DO)*; U77 1(STATE)* 6(EN)*

### Notes on the sheet
- MAIN SYSTEM
- POWER RAILS
- Mini environmental station with STM32
- Embedded System Design - Group 8
- MSc. Bui Quoc Bao
- 5 of 5
- Pham Thanh Vinh

### Library data of the parts
* = CMP-00002-1: vinh
BT1 = CMP-00029-00000-1: MS Lihium Rechargeable Battery, 3 V, -20 to 60 degC, Tray; RoHS Compliant: NotApplicable; Mounting Technology: WithLeads; Pins: 2
C13-C16 C18-C20 = CMP-001-00004-6: Chip Capacitor, 1 uF, +/- 10%, 16 V, 0603 (1608 Metric); Capacitor Type: Ceramic; Mounting Technology: SM; RoHS Compliant: True; Min Operating Temperature: -55°C; Case/Package: 0603; Pins: 2; Voltage Rating: 16V; Max Operating Temperature: 125°C; Tolerance: 10%
C17 = CMP-001-00061-3: Chip Capacitor, 100nF +/-20%, 10V, 0402, Thickness 0.6 mm; Tolerance: 20%; Mounting Technology: SMT; Voltage Rating: 10V; Max Operating Temperature: 85°C; Pins: 2; Case/Package: 0402; Min Operating Temperature: -55°C
D3-D5 = CMP-004-00005-2: Schottky Barrier Rectifier, 40 V, 1 A, -65 to 125 degC, 2-Pin SOD123, RoHS, Tape and Reel; Manufacturer: Micro Commercial Components; Datasheet Version: Rev. B, 01/2013; RoHS Compliant: Unknown; Manufacturer URL: http://www.mccsemi.com/; Package URL: http://www.mccsemi.com/up_pdf/1N4448W(SOD-123).pdf; Case/Package: SOD123; Mounting Technology: SM; Datasheet URL: http://www.mccsemi.com/up_pdf/B5817W-B5819W(SOD-123).pdf; Package Description: 2-Pin Small Outline Diode, Body 2.7 x 1.6 mm, Height 1.35 mm; Package Reference: SOD123
DS1 = CMP-007-00000-2: Chip LED, White, 5 V, 10 mA, 30 mW, -40 to 85 degC, 2-Pin SMD (0402), RoHS, Tape and Reel; Manufacturer: Everlight Electronics; Luminous Intensity: 360mcd; Forward Voltage: 2.6V; Viewing Angle: 130degrees; Power: 30mW; Forward Current: 5mA; Package Quantity: 3000; Max Operating Temperature: 85°C; Datasheet Version: Rev. 5, 04/2013; Datasheet URL: http://www.everlight.com/file/ProductFile/16-219A-T2D-AR2T1QY-3T.pdf; Package Reference: 0402; Mounting Technology: SM; Case/Package: 0402; Illumination Colour: White; Manufacturer URL: http://www.everlight.com/; Package Description: 2-Pin Surface Mount Device, Body 1 x 0.5 mm; RoHS Compliant: True; Packaging: TapeandReel; Min Operating Temperature: -40°C
FB1 = CMP-06046-002585-1: Chip Ferrite Bead, 0805, 150Ω @ 100MHz, 0.21Ω, 25%, 600mA
LS1 = CMP-00027-00002-1: 12.8 mm, 5 Vdc, 92 dB, 2.4 kHz, Surface Mount (SMT), Driving Circuit, Magnetic Audio Indicator Buzzer; Mounting Technology: Surface Mount
P1 = CMP-002-00100-1: Header, 4-Pin; Pins: 4; Source: PIF_Schematic_Lib.SchLib; LatestRevisionNote: Re-released for DXP Platform.; Component Type: Standard; Design Item ID: Header 4; LatestRevisionDate: 17-Jul-2002; Publisher: Altium Limited
Q1 = CMP-013-00034-1: TRANS NPN, 40V, 600MA, SOT23-3; Power Dissipation: 250mW; DC Current Gain: 35-300; Gain Bandwidth Product fT: 250MHz; Component Type: Standard; Supplier 2 URL: https://www.digikey.com/en/products/detail/diotec-semiconductor/MMBT2222A/13163394; Supplier 1 SN: 637-MMBT2222A; Supplier 3 SN: N/A; Design Item ID: MMBT2222A; Pins: 3; Supplier 1 Name: Mouser; Value: MMBT2222A; Supplier 3 Name: thegioiic; Supplier 1 URL: https://www.mouser.vn/ProductDetail/Diotec-Semiconductor/MMBT2222A?qs=OlC7AqGiEDl9N1c3%252BL%2F%252Brw%3D%3D; Transistor Type: NPN; Current - Collector: 600mA; Case/Package: SOT-23; Supplier 2 SN: 2796-MMBT2222ATR-ND; Voltage - Collector Emitter Breakdown: 40V; Supplier 3 URL: https://www.thegioiic.com/mmbt2222a-transistor-npn-40v-0-6a-3-chan-sot-23; Source: BJT.SchLib; Supplier 2 Name: Digi-Key
R2-R12 = CMP-009-00066-2: 10K 0.063W 1% 0402 (1005 Metric)  SMD; Power: 63mW; Case/Package: 0402; Mounting Technology: SMT; Pins: 2; Tolerance: 1%
SW1-SW4 = CMP-011-00011-3: Ultra-small Surface-mounting Tactile Switches with High Contact Reliability, SPST-NO, -25 to 70 degC, 2-Pin SMD, RoHS, Tape and Reel; Voltage Rating: 12V; Current Rating: 50mA; Pins: 2; RoHS Compliant: Details
U4 = CMP-031-00032-1: ARM Microcontrollers - MCU 32BIT Cortex M3 64KB 20KB RAM 2X12 ADC; Manufacture SN: STM32F103C8T6TR; Manufacturer: STM; Pad count: 48; Supplier 3 SN: STM32F103C8T6; Supplier 1 SN: 511-STM32F103C8T6; Supplier 3 URL: https://www.thegioiic.com/stm32f103c8t6-32-bit-arm-cortex-m3-microcontroller-72mhz-64kb-flash-48-lqfp; ComponentLink3Description: Supplier 2 URL; Value: STM32F103C8T6; Design Item ID: STM32F103C8T6; ComponentLink4Description: Supplier 3 URL; Supplier 2 SN: 497-17666-2-ND; ComponentLink2URL: https://www.mouser.com/ProductDetail/STMicroelectronics/STM32F103C8T6?qs=bhCVus9SdFtq6kqxsU5%2FDA%3D%3D; ComponentLink3URL: 497-17666-2-ND; Supplier 2 URL: https://www.digikey.com/en/products/detail/stmicroelectronics/stm32f103c8t6tr/2122442; Component Type: Standard; ComponentLink4URL: https://www.thegioiic.com/stm32f103c8t6-32-bit-arm-cortex-m3-microcontroller-72mhz-64kb-flash-48-lqfp; Supplier 1 URL: https://www.mouser.com/ProductDetail/STMicroelectronics/STM32F103C8T6?qs=bhCVus9SdFtq6kqxsU5%2FDA%3D%3D; ComponentLink1Description: Datasheet; Supplier 1 Name: Mouser; ComponentLink1URL: https://www.mouser.com/datasheet/2/389/stm32f103c8-1851025.pdf; Pins: 48; Part Number: STM32F103C8T6; ComponentLink2Description: Supplier 1 URL; Source: STM32.SchLib; Supplier 3 Name: thegioiic; Footprint name: LQFP48; Supplier 2 Name: Digi-Key
U34 = CMP-002-00117-2: 8-bit 2.5- to 5.5-V I2C/SMBus I/O expander with interrupt 16-PDIP -40 to 85; Pins: 16; Case/Package: PDIP; Min Operating Temperature: -40°C; Max Operating Temperature: 85°C
U35 = CMP-00003-6: Gas sensor; Pins: 4; Sensor Type: gas
U76 = CMP-00001-4: USB-to-UART TTL adapter.
U77 = CMP-00025-00003-6: Bluetooth module with UART communication
Y1 = CMP-003-00004-2: Resistance Weld Crystal, 8 MHz, +/- 30 ppm, 20 pF, -20 to 70 degC, 2-Pin SMD, RoHS, Tape and Reel; Manufacturer: FOX Electronics; Resistance: 80Ohm; Load Capacitance: 20pF; ESR: 80; Frequency Tolerance: 30ppm; Tolerance: 50ppm; Max Operating Temperature: 70°C; Pins: 2; Case/Package: HC49SDLF; Min Operating Temperature: -20°C; Mounting Technology: SM; Packaging: CutTape; Package Description: 2-Pin Surface Mount Device, Body 5 x 11.7 mm; RoHS Compliant: True; Frequency: 8MHz; Package Reference: HC49SDLF; Package Quantity: 1; Manufacturer URL: http://www.foxonline.com/; Datasheet Version: Mar-15; Datasheet URL: http://www.foxonline.com/pdfs/hc49sdlf.pdf
Y2 = CMP-003-00004-2: Resistance Weld Crystal, 8 MHz, +/- 30 ppm, 20 pF, -20 to 70 degC, 2-Pin SMD, RoHS, Tape and Reel; Manufacturer: FOX Electronics; Resistance: 80Ohm; Load Capacitance: 20pF; ESR: 80; Frequency: 8MHz; Frequency Tolerance: 30ppm; Tolerance: 50ppm; Max Operating Temperature: 70°C; Pins: 2; Case/Package: HC49SDLF; Min Operating Temperature: -20°C; Mounting Technology: SM; Packaging: CutTape; Package Description: 2-Pin Surface Mount Device, Body 5 x 11.7 mm; RoHS Compliant: True; Package Reference: HC49SDLF; Package Quantity: 1; Manufacturer URL: http://www.foxonline.com/; Datasheet Version: Mar-15; Datasheet URL: http://www.foxonline.com/pdfs/hc49sdlf.pdf

## Nets that join several sheets
+3.3V: Powersupply (6 pins), Mainsystem (19 pins)
+5V: Powersupply (5 pins), Mainsystem (D3.2 LS1.1 U35.1 U77.5)
GND: Powersupply (19 pins), Mainsystem (26 pins)